# EAGLE design LiPo-Charger-Basic-MiniUSB-v10 (EAGLE 5.11)
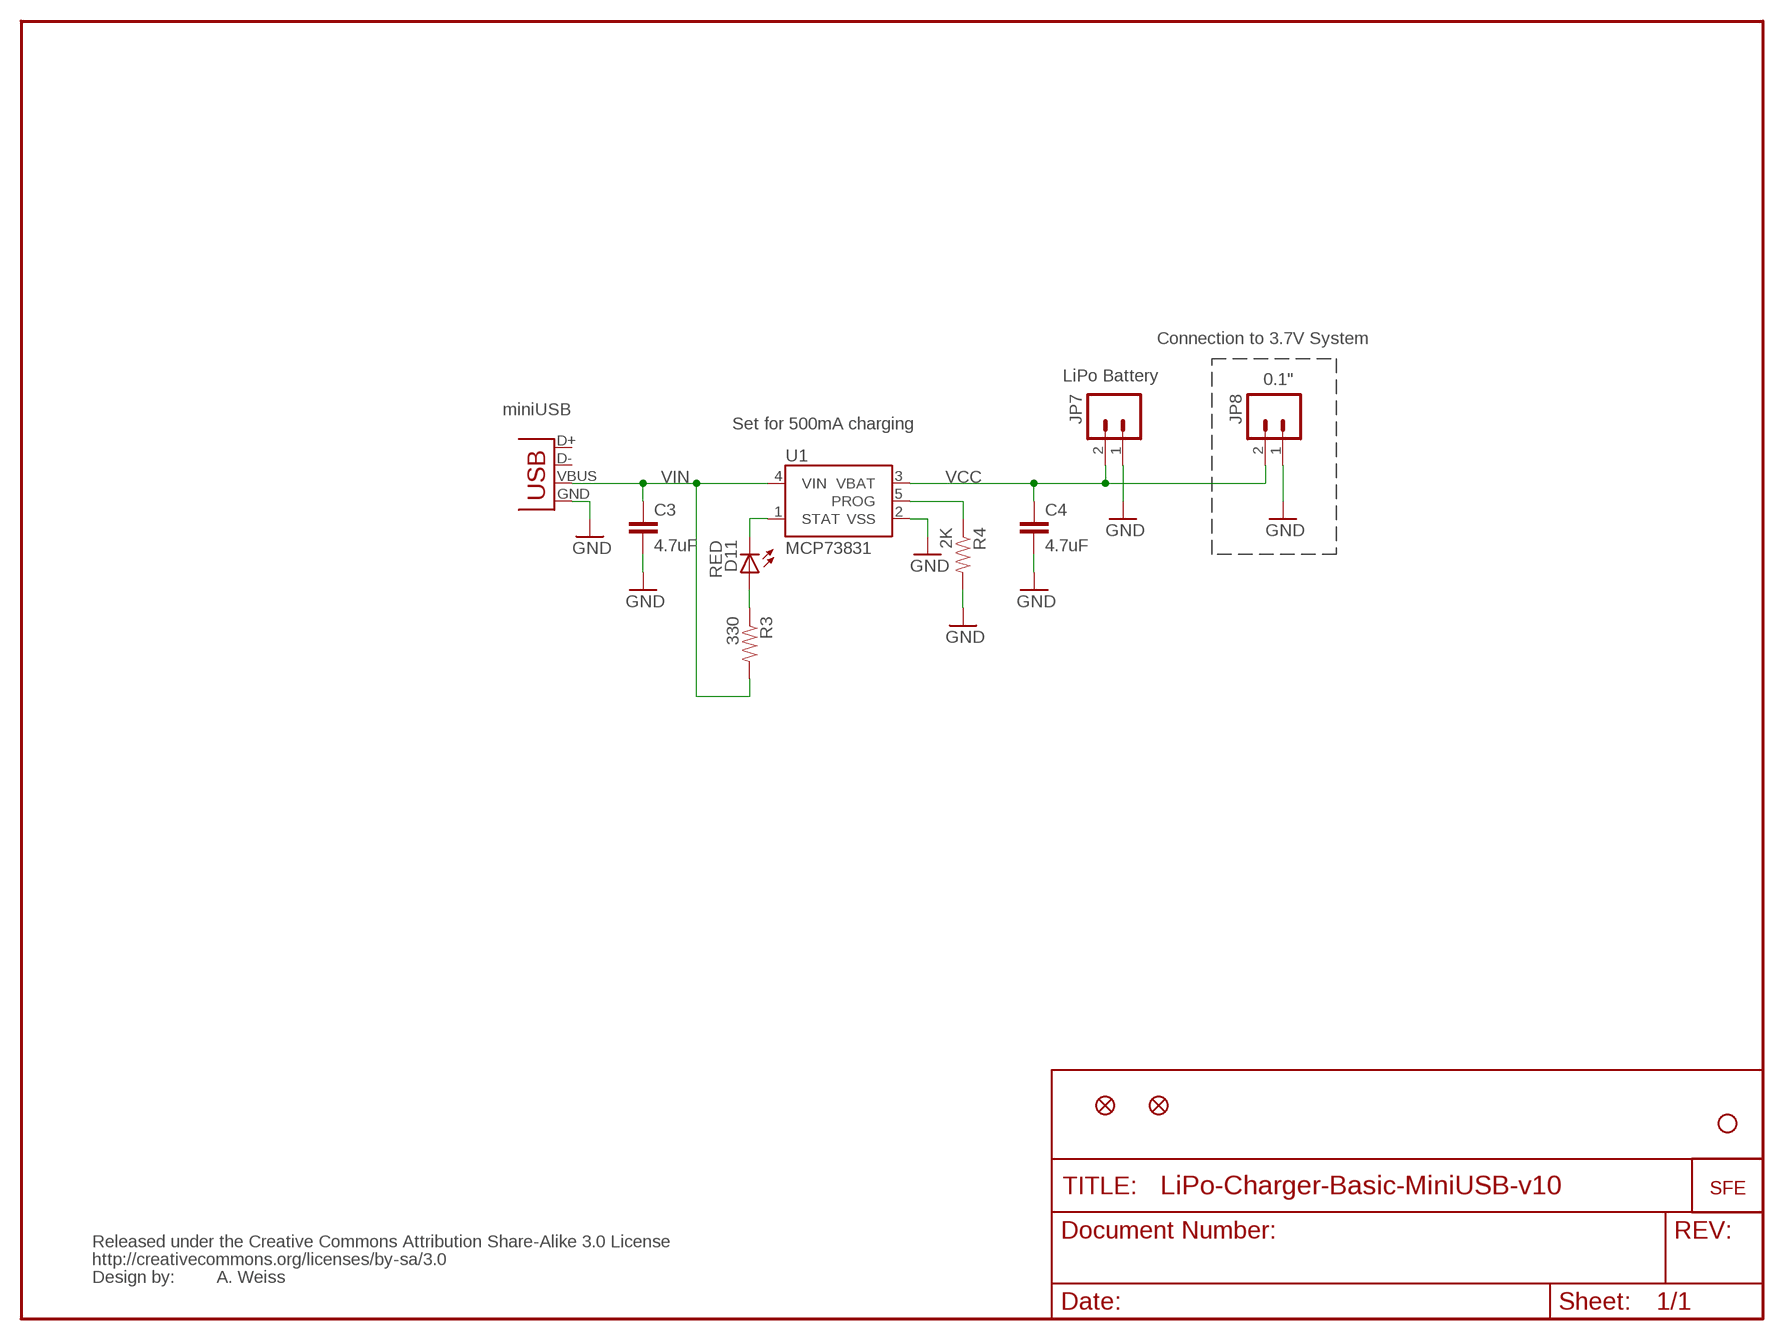
[diagram p0: schematic, sheet 1]

## Parts
C3  4.7uF  CAP0402-CAP  [0402-CAP]
C4  4.7uF  CAP0402-CAP  [0402-CAP]
D11  RED  LED0603  [LED-0603]
JP1  LOGO-SFESK  [SFE-LOGO-FLAME]
JP2  STAND-OFF  [STAND-OFF]
JP3  FIDUCIAL1X2  [FIDUCIAL-1X2]
JP4  FIDUCIAL1X2  [FIDUCIAL-1X2]
JP7  LiPo Battery  M02-JST-2MM-SMT  [JST-2-SMD]
JP8  M02PTH  [1X02]
R3  330  RESISTOR0402-RES  [0402-RES]
R4  2K  RESISTOR0402-RES  [0402-RES]
U1  MCP73831  [SOT23-5]
U$1  CREATIVE_COMMONS  [CREATIVE_COMMONS]
X1  Micro USB  USBSMD  [USB-MINIB]

## Nets
GND: C3.2 C4.2 JP7.1 JP8.1 R4.2 U1.2(VSS) X1.GND
N$3: D11.A R3.1
PROG: R4.1 U1.5(PROG)
STAT: D11.C U1.1(STAT)
VCC: C4.1 JP7.2 JP8.2 U1.3(VBAT)
VIN: C3.1 R3.2 U1.4(VIN) X1.VBUS
Unconnected: X1.D+ X1.D-

## Notes on the sheet
- Connection to 3.7V System
- 0.1"
- miniUSB
- Set for 500mA charging
- A. Weiss

## Library data of the parts
C3 C4 = SparkFun:CAP: Capacitor Standard 0603 ceramic capacitor, and 0.1" leaded capacitor.
D11 = SparkFun:LED: LEDs Standard schematic elements and footprints for 5mm, 3mm, 1206, and 0603 sized LEDs. 5mm - Spark Fun Electronics SKU : COM-00529 (and others)
JP1 = SparkFun:LOGO-SFE: Spark Fun Electronics PCB Logo This is the standard Spark Fun Electronics PCB logo.
JP2 = SparkFun:STAND-OFF: Stand Off This is the mechanical footprint for a #4 phillips button head screw. Use the keepout ring to avoid running the screw head into surrounding components. SKU : PRT-00447
JP3 JP4 = SparkFun:FIDUCIAL: Fiducial Alignment Points Various fiducial points for machine vision alignment.
JP7 JP8 = SparkFun:M02: Header 2 Standard 2-pin 0.1" header. Use with straight break away headers (SKU : PRT-00116), right angle break away headers (PRT-00553), swiss pins (PRT-00743), machine pins (PRT-00117), and female headers (PRT-00115). Molex polarized connector foot print use with SKU : PRT-08233 with associated crimp pins and housings.
R3 R4 = SparkFun:RESISTOR: Resistor Basic schematic elements and footprints for 0603, 1206, and PTH resistors.
U1 = SparkFun:MCP73831: Microchip's MCP73831 Miniature single cell, fully integrated Li-Ion, Li-polymer charge management controller http://ww1.microchip.com/downloads/en/DeviceDoc/21984a.pdf
U$1 = SparkFun:CREATIVE_COMMONS
X1 = SparkFun:USB: USB Connectors USB-B-PTH is fully proven SKU : PRT-00139 USB-miniB is fully proven SKU : PRT-00587 USB-A-PCB is untested. USB-A-H is throughly reviewed, but untested. Spark Fun Electronics SKU : PRT-00437 USB-B-SMT is throughly reviewed, but untested. Needs silkscreen touching up. USB-A-S has not been used/tested USB-MB-H has not been used/tested

## Board
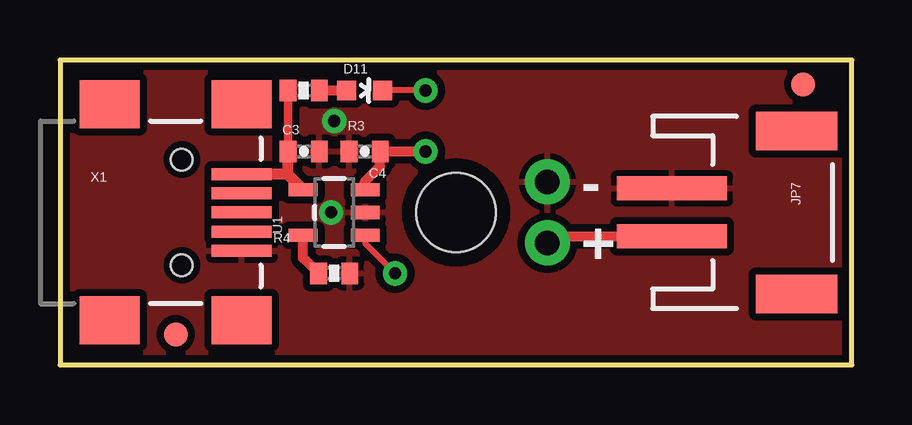
[diagram p1: board, top side]
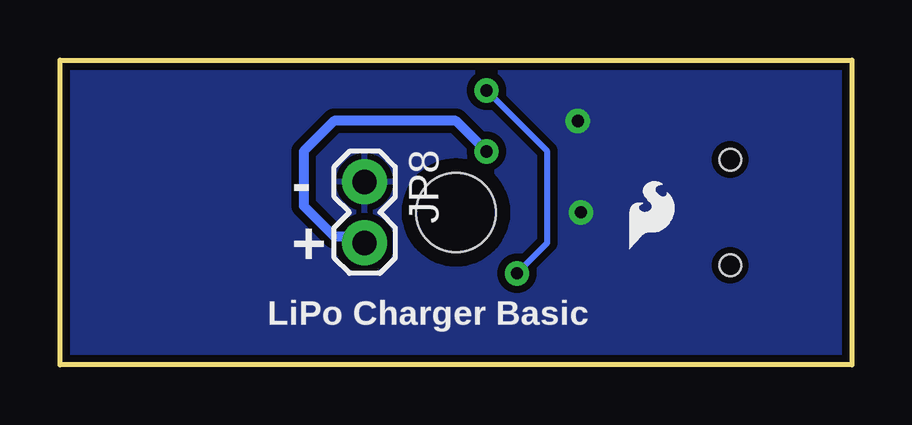
[diagram p2: board, bottom side, seen from below]

Size 33.02 x 12.7 mm. Coordinates in mm from the lower left corner, seen from the top.
Outline: 33.02,0 33.02,12.7 0,12.7 0,0 33.02,0
Copper layers (1*16): Top 0.035mm / dielectric 1.5mm / Bottom 0.035mm
Design rules "SparkFun": minimum track width 8mil, minimum drill 20mil, track to track 8mil, track to pad 8mil, pad to pad 8mil, via to via 8mil, smd to smd 8mil, copper to edge 8mil, drill to drill 8mil, minimum pad ring 12mil, minimum via ring 10mil, stop-mask expansion 4mil, vias tented up to drill 20mil, thermal gap 10mil

### Footprints (pad centres in the part's own frame; a part is rotated, then mirrored left to right if it is on the bottom)
0402-CAP = smd 0.7 x 0.9: 1 -0.65,0; 2 0.65,0
LED-0603 = smd 0.8 x 0.8: A 0,-0.75; C 0,0.75
STAND-OFF = hole 3.302: 0,0
FIDUCIAL-1X2 = smd 1 x 1: 1 0,0
JST-2-SMD = smd 1 x 4.6: 1 -1,-3.7; 2 1,-3.7 | smd 1.6 x 3.4: NC1 -3.4,1.5; NC2 3.4,1.5
1X02 = drill 1.016 pad 1.88 round: 1 0,0; 2 2.54,0
0402-RES = smd 0.7 x 0.9: 1 -0.65,0; 2 0.65,0
SOT23-5 = smd 0.55 x 1.2: 1 -0.95,-1.3; 2 0,-1.3; 3 0.95,-1.3; 4 0.95,1.3; 5 -0.95,1.3
USB-MINIB = smd 2.5 x 0.5: D+ 2.5,0; D- 2.5,0.8; GND 2.5,-1.6; ID 2.5,-0.8; VBUS 2.5,1.6 | smd 2.5 x 2: MTN1 -3,4.5; MTN2 2.5,4.5; MTN3 -3,-4.5; MTN4 2.5,-4.5 | hole 0.9: 0,2.2; 0,-2.2

### Placement (x,y rotation side)
C3  10.16,8.89 0 top
C4  12.7,8.89 180 top
D11  12.7,11.43 270 top
JP1  9.27,4.83 0 bottom
JP2  16.51,6.35 0 top
JP3  4.83,1.27 0 top
JP4  30.99,11.68 0 top
JP7  29.21,6.35 270 top
JP8  20.32,7.62 270 bottom
R3  10.16,11.43 180 top
R4  11.43,3.81 0 top
U1  11.43,6.35 90 top
U$1  -22.86,-8.89 0 top  (outside the outline)
X1  5.08,6.35 0 top

### Tracks (layer width: path | path; a pad name or v marks a point on that pad's centre or on a via)
GND  (via drill 0.51)
  other vias: 11.3,6.35 11.43,10.16
  pour Bottom (isolate 0.305): 0,0 0,12.7 33.02,12.7 33.02,0
  pour Top (isolate 0.305): 0,12.7 33.02,12.7 33.02,0 0,0
N$3
  Top 0.406: R3.1 D11.A
PROG
  Top 0.406: U1.5 10.13,4.46 R4.1
STAT  (via drill 0.51)
  Top 0.254: v15.24,11.43 D11.C | U1.1 12.73,5.05 v13.97,3.81
  Bottom 0.254: v13.97,3.81 12.7,5.08 12.7,8.89 v15.24,11.43
VCC  (via drill 0.51)
  Top 0.406: v15.24,8.89 C4.1 13.35,8.27 12.7,7.62 12.7,7.33 U1.3 | JP7.2 20.59,5.35 JP8.2
  Bottom 0.406: v15.24,8.89 16.51,10.16 21.59,10.16 22.86,8.89 22.86,6.62 21.59,5.35 20.59,5.35 JP8.2
VIN
  Top 0.356: C3.1 R3.2
  Top 0.457: 9.51,7.92 C3.1 | 9.51,7.92 U1.4 | X1.VBUS 9.48,7.95 9.51,7.92

### Text on the board
tPlace: - | + | A. Weiss
bPlace: - | + | LiPo Charger Basic